# EAGLE schematic adc121c027 (EAGLE 9.2.0)
PROJECT_AUTHOR: tinkerman.cat <xose.perez@gmail.com>; PROJECT_LICENSE: MIT; PROJECT_NAME: SONOFF TH - EMON ADC121C027; PROJECT_VERSION: 0.1.20181223
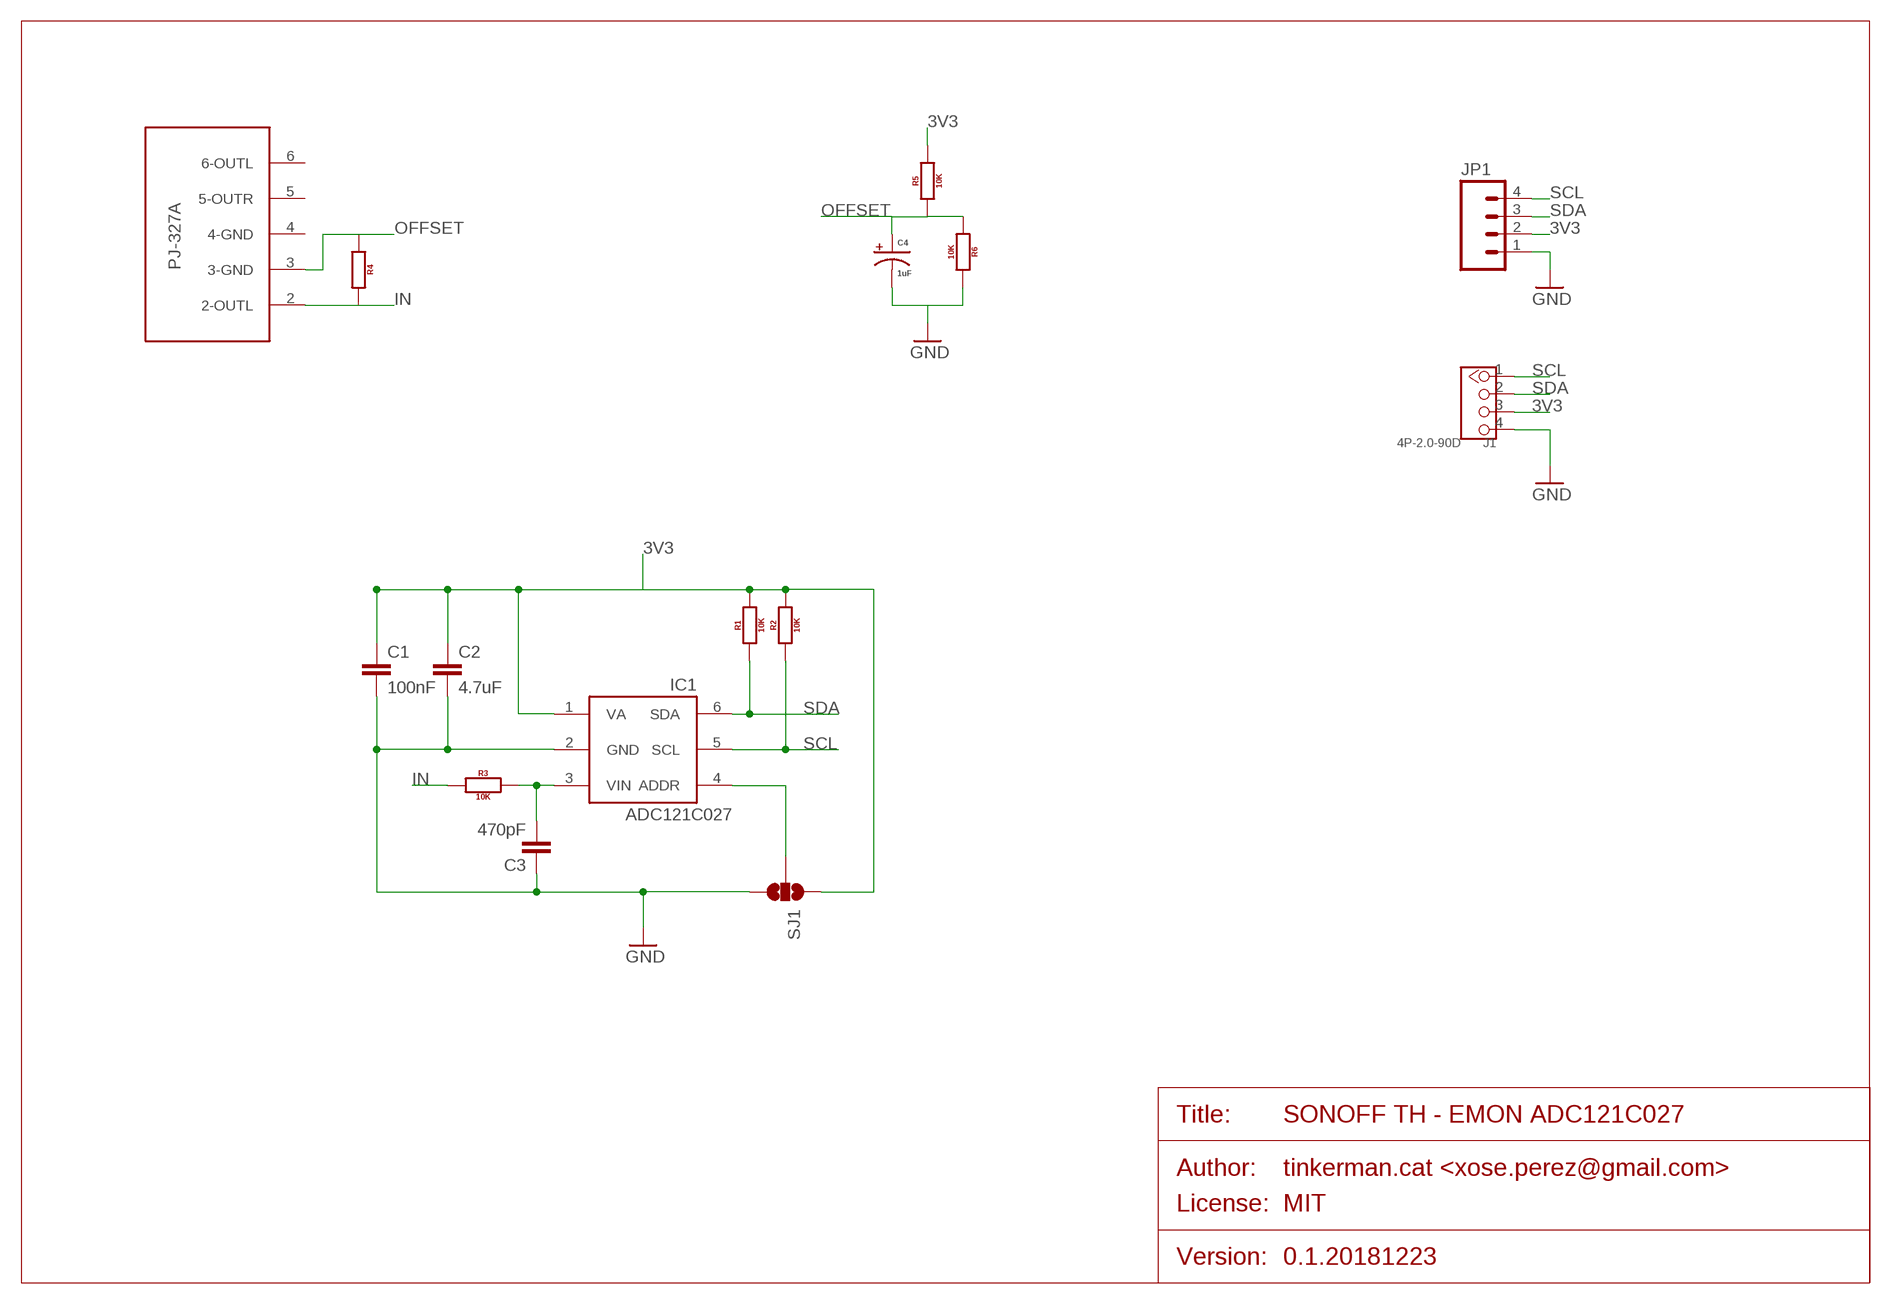
[diagram p0: schematic, sheet 1]

## Parts
C1  100nF  C-EU0805  [0805]
C2  4.7uF  C-EU0805  [0805]
C3  470pF  C-EU0805  [0805]
C4  1uF  CAP_POLC  [PANASONIC_C]
CURR1  PJ-327A  [PJ-327A]
IC1  ADC121C027  [SOT23-6]
J1  4P-2.0-90D  GROVE-CONNECTOR-DIP-90D(4P-2.0)  [HW4-2.0-90D]
JP1  M04PTH  [1X04]
R1  10K  RESISTOR0805  [0805]
R2  10K  RESISTOR0805  [0805]
R3  10K  RESISTOR0805  [0805]
R4  RESISTOR0805  [0805]
R5  10K  RESISTOR0805  [0805]
R6  10K  RESISTOR0805  [0805]
SJ1  SOLDERJUMPER_2WAYS  [SJ_3]

## Nets
3V3: C1.1 C2.1 IC1.1(VA) J1.3 JP1.2 R1.2 R2.2 R5.2 SJ1.1
GND: C1.2 C2.2 C3.1 C4.- IC1.2(GND) J1.4 JP1.1 R6.2 SJ1.3
IN: CURR1.2(2-OUTL) R3.1 R4.2
N$1: C3.2 IC1.3(VIN) R3.2
N$3: IC1.4(ADDR) SJ1.2
OFFSET: C4.+ CURR1.3(3-GND) R4.1 R5.1 R6.1
SCL: IC1.5(SCL) J1.1 JP1.4 R2.1
SDA: IC1.6(SDA) J1.2 JP1.3 R1.1
Unconnected: CURR1.4(4-GND) CURR1.5(5-OUTR) CURR1.6(6-OUTL)

## Library data of the parts
C1-C3 = xose:C-EU: CAPACITOR, European symbol
C4 = xose:CAP_POL: Capacitor Polarized These are standard SMD and PTH capacitors. Normally 10uF, 47uF, and 100uF in electrolytic and tantalum varieties. Always verify the external diameter of the through hole cap, it varies with capacity, voltage, and manufacturer. The EIA devices should be standard.
CURR1 = PJ-327A:PJ-327A
IC1 = xose:ADC121C027
J1 = Seeed-Connector -2016:GROVE-CONNECTOR-DIP-90D(4P-2.0): 320110034
JP1 = xose:M04: Header 4 Standard 4-pin 0.1" header. Use with straight break away headers (SKU : PRT-00116), right angle break away headers (PRT-00553), swiss pins (PRT-00743), machine pins (PRT-00117), and female headers (PRT-00115). Molex polarized connector foot print use with SKU : PRT-08231 with associated crimp pins and housings. 1MM SMD Version SKU: PRT-10208
R1-R6 = xose:RESISTOR: Generic EU resistor symbol
SJ1 = xose:SOLDERJUMPER_2WAY: Solder Jumper 2 way solder jumper